# Altium schematic sheet 90_CAN.SchDoc
size A4; SheetNumber: 10; SheetTotal: 12
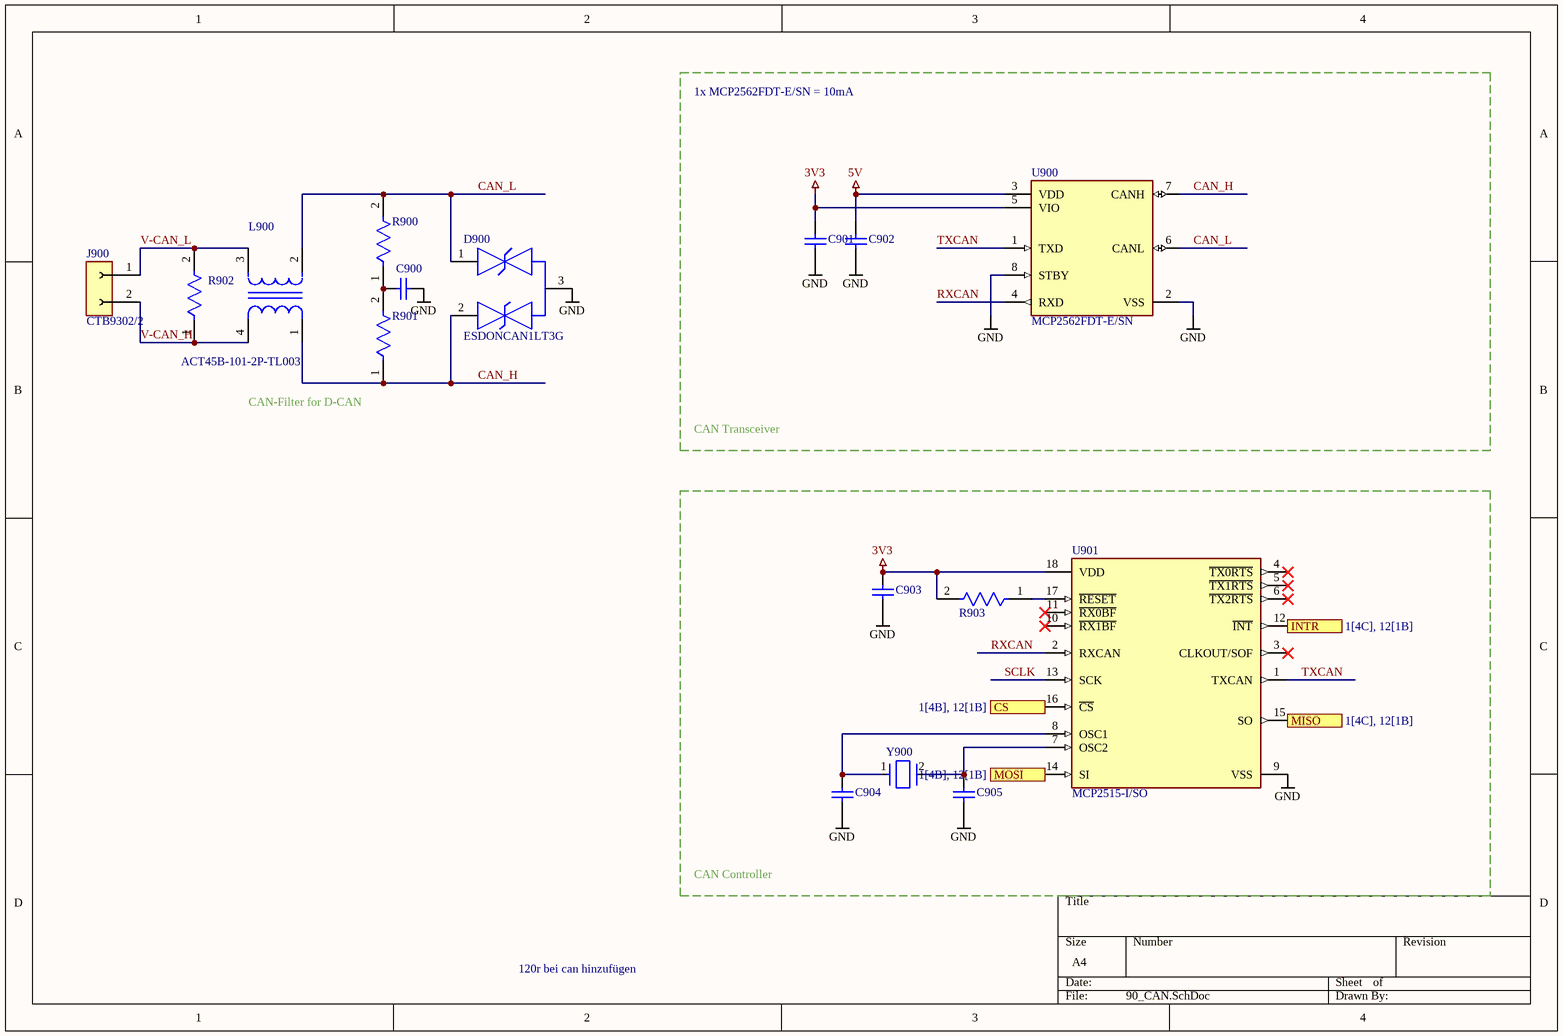
[diagram p0: 90_CAN.SchDoc]

## Parts
C900  GRM188R71H472KA01D  [CAPC1608X90X35ML10T15]  (value not drawn)
C901  GRM188R71H104KA93D  [CAPC1608X90X35ML10T15]  (value not drawn)
C902  GRM188R71H104KA93D  [CAPC1608X90X35ML10T15]  (value not drawn)
C903  GRM188R71H104KA93D  [CAPC1608X90X35ML10T15]  (value not drawn)
C904  GRM1885C1H220JA01D  [CAPC1608X90X35ML10T15]  (value not drawn)
C905  GRM1885C1H220JA01D  [CAPC1608X90X35ML10T15]  (value not drawn)
D900  ESDONCAN1LT3G  [FP-318-MFG]
J900  CTB9302/2  [CTB9302-2]
L900  ACT45B-101-2P-TL003  [FP-ACT45B-MFG]
R900  CRCW06034K70FKEA  [FP-CRCW0603-e3-IPC_A]  (value not drawn)
R901  CRCW06034K70FKEA  [FP-CRCW0603-e3-IPC_A]  (value not drawn)
R902  CRCW0603120RFKEA  [FP-CRCW0603-e3-MFG]  (value not drawn)
R903  CRCW06034K70FKEA  [FP-CRCW0603-e3-IPC_A]  (value not drawn)
U900  MCP2562FDT-E/SN  [FP-C04-057-SN-MFG]
U901  MCP2515-I/SO  [FP-C04-051-MFG]
Y900  ABLS-16.000MHZ-K4T  [FP-ABLS-MFG]  (value not drawn)

## Blocks framed on the sheet
CAN Controller: C903-C905 R903 U901 Y900

## Ports
CS (in, see 1[4B], 12[1B]), INTR (see 1[4C], 12[1B]), MISO (see 1[4C], 12[1B]), MOSI (see 1[4B], 12[1B])

## Nets
3V3: C901.2 C903.2 R903.2 U900.5(VIO) U901.18(VDD)
5V: C902.2 U900.3(VDD)
GND: C900.2 C901.1 C902.1 C903.1 C904.1 C905.1 D900.3 U900.2(VSS) U900.8(STBY) U901.9(VSS)
CAN_H: D900.2 L900.1 R901.1 U900.7(CANH)
CAN_L: D900.1 L900.2 R900.2 U900.6(CANL)
CS: U901.16(~{CS}) ; port CS
INTR: U901.12(~{INT}) ; port INTR
MISO: U901.15(SO) ; port MISO
MOSI: U901.14(SI) ; port MOSI
RXCAN: U900.4(RXD) U901.2(RXCAN)
SCLK: U901.13(SCK)
TXCAN: U900.1(TXD) U901.1(TXCAN)
V-CAN_H: J900.2 L900.4 R902.1
V-CAN_L: J900.1 L900.3 R902.2
NetC900_1: C900.1 R900.1 R901.2
NetC904_2: C904.2 U901.8(OSC1) Y900.1
NetC905_2: C905.2 U901.7(OSC2) Y900.2
NetR903_1: R903.1 U901.17(~{RESET})

Not connected (* = marked no-connect by the designer): U901 3(CLKOUT/SOF)* 4(~{TX0RTS})* 5(~{TX1RTS})* 6(~{TX2RTS})* 10(~{RX1BF})* 11(~{RX0BF})*

## Notes on the sheet
- 1x MCP2562FDT-E/SN = 10mA
- (near R901) CAN-Filter for D-CAN
- CAN Transceiver
- 120r bei can hinzufügen

## Library data of the parts
C900 = CMP-2006-02924-1: Manufacturer: Murata; Part Number: GRM188R71H472KA01D
C901-C903 = CMP-2100-03643-1: Chip Capacitor, 0.1 uF, +/- 10%, 50 V, -55 to 125 degC, 0603 (1608 Metric), RoHS, Tape and Reel; Manufacturer: Murata; Dielectric Material: Ceramic; Voltage Rating: 50V; Capacitance: 100nF; Dielectric: X7R; Insulation Resistance: 10GR; Case Code (Metric): 1608; Lead Free: LeadFree; Depth: 0.8mm; Number of Pins: 2; Radiation Hardening: No; Case/Package: 0603; Manufacturer URL: http://www.murata.com/; Packaging: TapeandReel; Length: 1.6mm; Contact Plating: Tin; Datasheet URL: http://psearch.en.murata.com/capacitor/product/GRM188R71H104KA93%23.pdf; Tolerance: 10%; Case Code (Imperial): 0603; Min Operating Temperature: -55degC; RoHSCompliant: true; Voltage: 50V; Termination: SMD/SMT; Mount: SurfaceMount; Material: Ceramic; Package Quantity: 1; Height: 0.8mm; Thickness: 0.035inch; REACH SVHC: NoSVHC; Max Operating Temperature: 125degC; Width: 0.8mm; Package Reference: 0603; Voltage Rating (DC): 50V; Datasheet Version: 42675.0; Package Description: 2-Pin Surface Mount Device, Body 1.6 x 0.8 mm
C904 C905 = CMP-2000-04945-1: Chip Capacitor, 22 pF, +/- 5%, 50 V, -55 to 125 degC, 0603 (1608 Metric), RoHS, Tape and Reel; Manufacturer: Murata; Capacitance: 22pF; Rated Voltage: 50V; Dielectric: C0G; Manufacturer URL: http://www.murata.com/; Datasheet Version: Jul-06; Package Reference: 603; Tolerance (%): ±5%; Case Size/Dimension: 0603; Package Description: 2-Pin Surface Mount Device, Body 1.6 x 0.8 mm; Datasheet URL: https://datasheet.ciiva.com/11786/0900766b807a1cab-11786398.pdf
D900 = CMP-00278-29932846-1: ESDONCAN1LT3G ESD Suppressor TVS Dual Bi-Dir 3-Pin SOT-23 T/R - Tape and Reel; Manufacturer Lifecycle Status: ACTIVE; Number of Bidirectional Channels: 2; Power Line Protection: No; Peak Pulse Current: 3A; Reverse Standoff Voltage: 24V; Min Breakdown Voltage: 26.2V; Clamping Voltage: 50V; Number of Pins: 3; RoHS: Compliant; Mount: Surface Mount; Packaging: Tape & Reel (TR); Min Operating Temperature: -55°C; Lifecycle Status: Production; Max Operating Temperature: 150°C; Composition: Zener; NexarPartId: 29932846; Case/Package: TO-236-3; Lead Free: Lead Free
J900 = CTB9302-2: CTB9302/2 - Stiftleiste - 2-pol, RM 5 mm, 0°
L900 = CMP-08256-000007-1: CMC 100UH 150MA 2LN SMD AEC-Q200; Manufacturer: TDK; Tolerance: +50/-30%; Rms Current: 0.15A; Automotive Grade: Grade 0; Series Resistance: 2Ω; Test Frequency: 100kHz; Impedance At Frequency: 5800Ω @ 10MHz; ComponentLink2URL: https://product.tdk.com/info/en/catalog/datasheets/cmf_automotive_signal_act45b_en.pdf; Octopart: https://octopart.com/act45b-101-2p-tl003-tdk-11353565; Lead Free: Yes; Manufacturer Part Number: ACT45B-101-2P-TL003; Mouser Description: Common Mode Chokes / Filters 5000ohms 100uH 150mA CAN-BUS AEC-Q200; Device Class L1: Passive Components; Automotive: Yes; Temperature Range High: +150°C; Device Class L2: EMI / RFI Components; ComponentLink2Description: Datasheet; Package: ACT45B; Category: Ind; Value: 100uH; RoHS: TRUE; Temperature: -40°C to +150°C; Height: 3mm; Inductance: 100uH; Digikey Description: CMC 100UH 150MA 2LN SMD AEC-Q200; Composition: Wirewound; Device Class L3: Common Mode Chokes; Temperature Range Low: -40°C
R900 R901 R903 = CMP-1666-00019-3: RES Thick Film, 4.7kΩ, 1%, 0.1W, 100ppm/°C, 0603; Resistance: 4.7kR; Voltage Rating: 75V; Power Rating: 100mW; Case Code (Metric): 1608; Military Standard: Not; Packaging: Tape and Reel; Termination: SMD/SMT; Temperature Coefficient: 100ppm/°C; Lead Free: Lead Free; Length: 1.55mm; Width: 0.85mm; Height: 0.45mm; Depth: 0.85mm; Weight: 7.1E-05oz; Case Code (Imperial): 0603; Contact Plating: Tin; Case/Package: 0603; Max Operating Temperature: 155°C; Mount: Surface Mount; Tolerance: 1%; Min Operating Temperature: -55°C; Package Quantity: 5000; Voltage Rating (DC): 75V; Composition: Thick Film
R902 = CMP-1666-00020-3: RES Thick Film, 120Ω, 1%, 0.1W, 100ppm/°C, 0603; Power Rating: 100mW; Working Voltage: 75V; Resistance: 120R; RoHS Compliant: Yes; Lead Free: Lead Free; Termination: SMD/SMT; Radiation Hardening: No; Case Code (Imperial): 0603; Series: CRCW; Resistance Tolerance: 1%; Number of Terminations: 2; Tolerance: 1%; Max Operating Temperature: 155°C; Contact Plating: Tin; Package Quantity: 10; Max Power Dissipation: 100mW; Case Code (Metric): 1608; Weight: 7.1E-05oz; Packaging: Tape and Reel; Mount: Surface Mount; Military Standard: Not; Construction: Rectangular; Features: Automotive AEC-Q200; Depth: 0.85mm; Min Operating Temperature: -55°C; Case/Package: 0603; Height: 0.45mm; Voltage Rating (DC): 75V; Width: 0.033inch; Technology: THICK FILM; Length: 1.55mm; Voltage Rating: 75V; Temperature Coefficient: 100ppm/°C; Resistor Type: Thick Film
U900 = CMP-06279-000005-1: IC TRANSCEIVER 1/1 8SOIC; Operating Supply Current: 70mA; Data Rate: 8Mbps; Number of Transceivers: 1; Receiver Hysteresis: 200mV; Max Supply Voltage: 5.5V; Min Supply Voltage: 4.5V; Weight: 0.019048oz; Package Quantity: 3300; Case/Package: SOIC; Mount: Surface Mount; Max Operating Temperature: 125°C; Min Operating Temperature: -40°C; Packaging: Tape and Reel; Number of Pins: 8
U901 = CMP-0186-00133-3: IC CAN CONTROLLER W/SPI 18SOIC; Manufacturer: Microchip; Min Supply Voltage: 2.7V; Max Supply Voltage: 5.5V; Standoff Height: 0.1mm; Nominal Supply Current: 10mA; Interface: SPI,CAN; Lead Free: Yes; Digikey Description: IC CAN CONTROLLER W/SPI 18SOIC; Category: IC; RoHS: TRUE; Manufacturer Part Number: MCP2515-I/SO; ComponentLink2URL: http://ww1.microchip.com/downloads/en/DeviceDoc/MCP2515-Stand-Alone-CAN-Controller-with-SPI-20001801J.pdf; Mouser Description: CAN Interface IC W/ SPI Interface; Device Class L2: Interface ICs; Package: C04-051; Automotive: No; Function: Controller; Octopart: https://octopart.com/mcp2515-i%2Fso-microchip-430187; Temperature: -40°C to +85°C; Ipc Land Pattern Name: SOIC127P1030X265-18; Ambient Temperature Range Low: -65°C; Height: 2.65mm; Device Class L1: Integrated Circuits (ICs); Ambient Temperature Range High: +125°C; Footprint Url: http://ww1.microchip.com/downloads/en/DeviceDoc/18L_SOIC_Wide_7.50_SO_C04-0051D.pdf; Temperature Range Low: -40°C; Device Class L3: Controllers; Temperature Range High: +85°C; ComponentLink2Description: Datasheet
Y900 = CMP-27762-000003-1: CRYSTAL 16.0000MHZ 18PF SMD; Manufacturer: Abracon; Frequency: 16MHz; Stability: 50ppm; Tolerance: 30ppm; Standoff Height: 0mm; Esr: 40Ω; ComponentLink2URL: https://abracon.com/Resonators/abls.pdf; Temperature Range High: +125°C; Package: ABLS; Device Class L3: Crystals; Temperature: -40°C to +125°C; Load Capacitance: 18pF; Device Class L2: Crystals / Oscillators; Mouser Description: Crystal 16MHz ±30ppm (Tol) ±50ppm (Stability) 18pF FUND 40Ohm 2-Pin HC-49/US SMD T/R; Category: Crys; ComponentLink2Description: Datasheet; Manufacturer Part Number: ABLS-16.000MHZ-K4T; Series: ABLS; Automotive: No; Octopart: https://octopart.com/abls-16.000mhz-k4t-abracon-18618626; RoHS: TRUE; Digikey Description: CRYSTAL 16.0000MHZ 18PF SMD; Temperature Range Low: -40°C; Lead Free: Yes; Height: 4.3mm; Device Class L1: Passive Components